# Altium project nestoGIT.PrjPcb
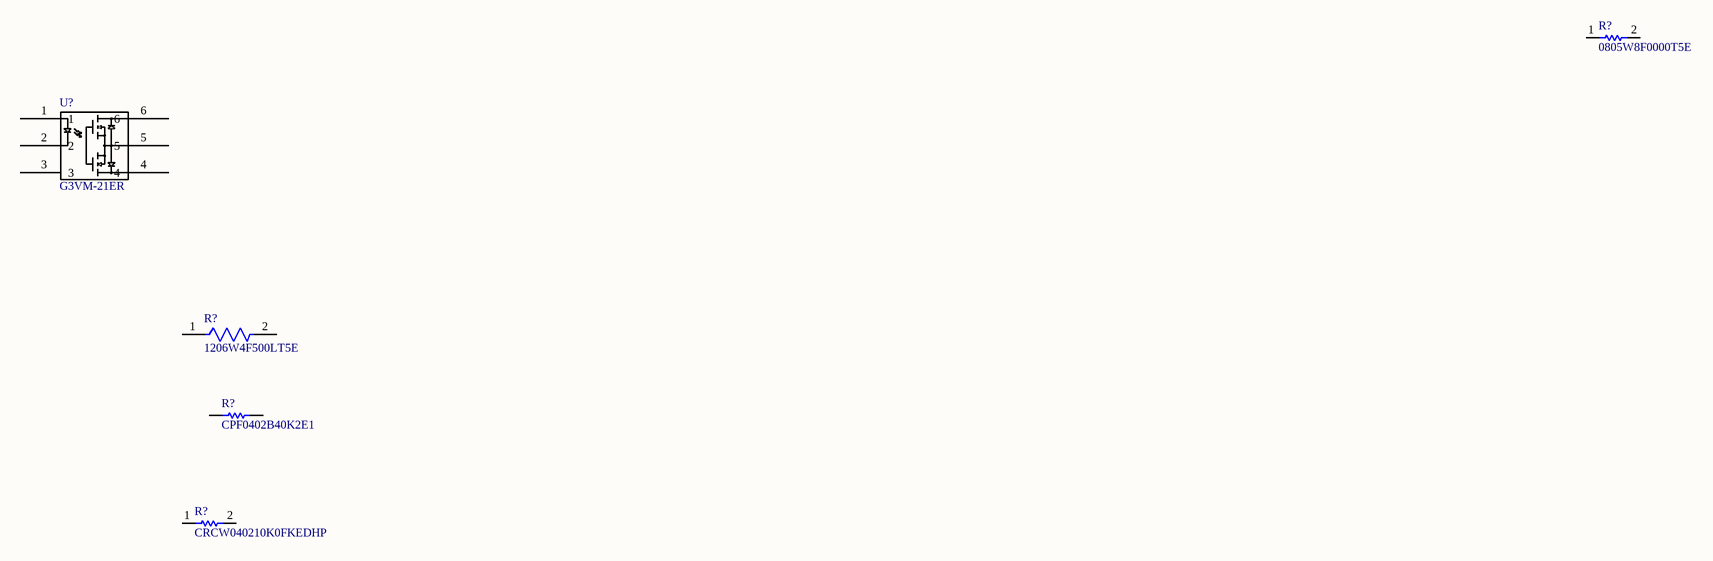
[diagram p0: Sheet1.SchDoc]
3 sheets, 21 parts. Net scope: global (net labels, ports and power ports of the same name join across sheets).
Sheets:
  Sheet1.SchDoc
  Sheet2.SchDoc
  Sheet3.SchDoc

## Sheet Sheet1.SchDoc
size A4; SheetNumber: 1; SheetTotal: 1

### Parts
(Parts that share a designator on the sheet are numbered #1, #2 ... from top to bottom, then left to right.)
R?#1  0805W8F0000T5E  [0805W8F0000T5E-Footprint-1]
R?#2  1206W4F500LT5E  [1206W4F500LT5E-Footprint-1]
R?#3  CPF0402B40K2E1  [RESC1005X35X20LL05T10]
R?#4  CRCW040210K0FKEDHP  [RESC1005X40X25NL05T10]
U?#1  G3VM-21ER  [G3VM-21ER-Footprint-1]

### Nets

Not connected (* = marked no-connect by the designer): R?#1 1 2; R?#2 1 2; R?#3 1 2; R?#4 1 2; U?#1 1 2 3 4 5 6

### Library data of the parts
R?#1 = CMP-003-00443-2: -55℃~+155℃ 0Ω 125mW 150V Thick Film Resistor ±1% ±800ppm/℃ 0805 Chip Resistor - Surface Mount ROHS; LCSC Part #: C17477
R?#2 = CMP-003-00393-1: -55℃~+155℃ 200V 250mW 500mΩ Thick Film Resistor ±1% ±800ppm/℃ 1206 Chip Resistor - Surface Mount ROHS; LCSC Part #: C25340
R?#3 = CMP-003-00249-1: Res Thin Film 0402 40.2K Ohm 0.1% 1/16W ±25ppm/°C Molded SMD SMD Paper T/R; Min Operating Temperature: -55°C; Width: 500µm; Max Operating Temperature: 155°C; Depth: 500µm; LCSC Part #: C4234771; Length: 990.6µm; Tolerance: 0.1%; Height: 300µm; Termination: Solder; Case/Package: 0402
R?#4 = CMP-003-00415-2: Res Thick Film 0402 10K Ohm 1% 0.2W ±100ppm/°C Molded SMD SMD Paper T/R; Max Operating Temperature: 155°C; Termination: SMD/SMT; Length: 1mm; Height: 300µm; Depth: 500µm; Lead Free: Lead Free; Packaging: Cut Tape; Pins: 2; Case/Package: 0402; Min Operating Temperature: -55°C; Tolerance: 1%; LCSC Part #: C71617; Width: 500µm
U?#1 = CMP-003-00232-1: Relay SSR 25mA 1.48V DC-IN 4A 16V AC/DC-OUT 6-Pin DIP SMD Stick; Length: 7.12mm; Height: 3.65mm; Max Operating Temperature: 65°C; Termination: Gull Wing; LCSC Part #: C6258783; Width: 6.4mm; Case/Package: SMD/SMT; Min Operating Temperature: -20°C; Pins: 6

## Sheet Sheet2.SchDoc
size A4; SheetNumber: 2; SheetTotal: 3
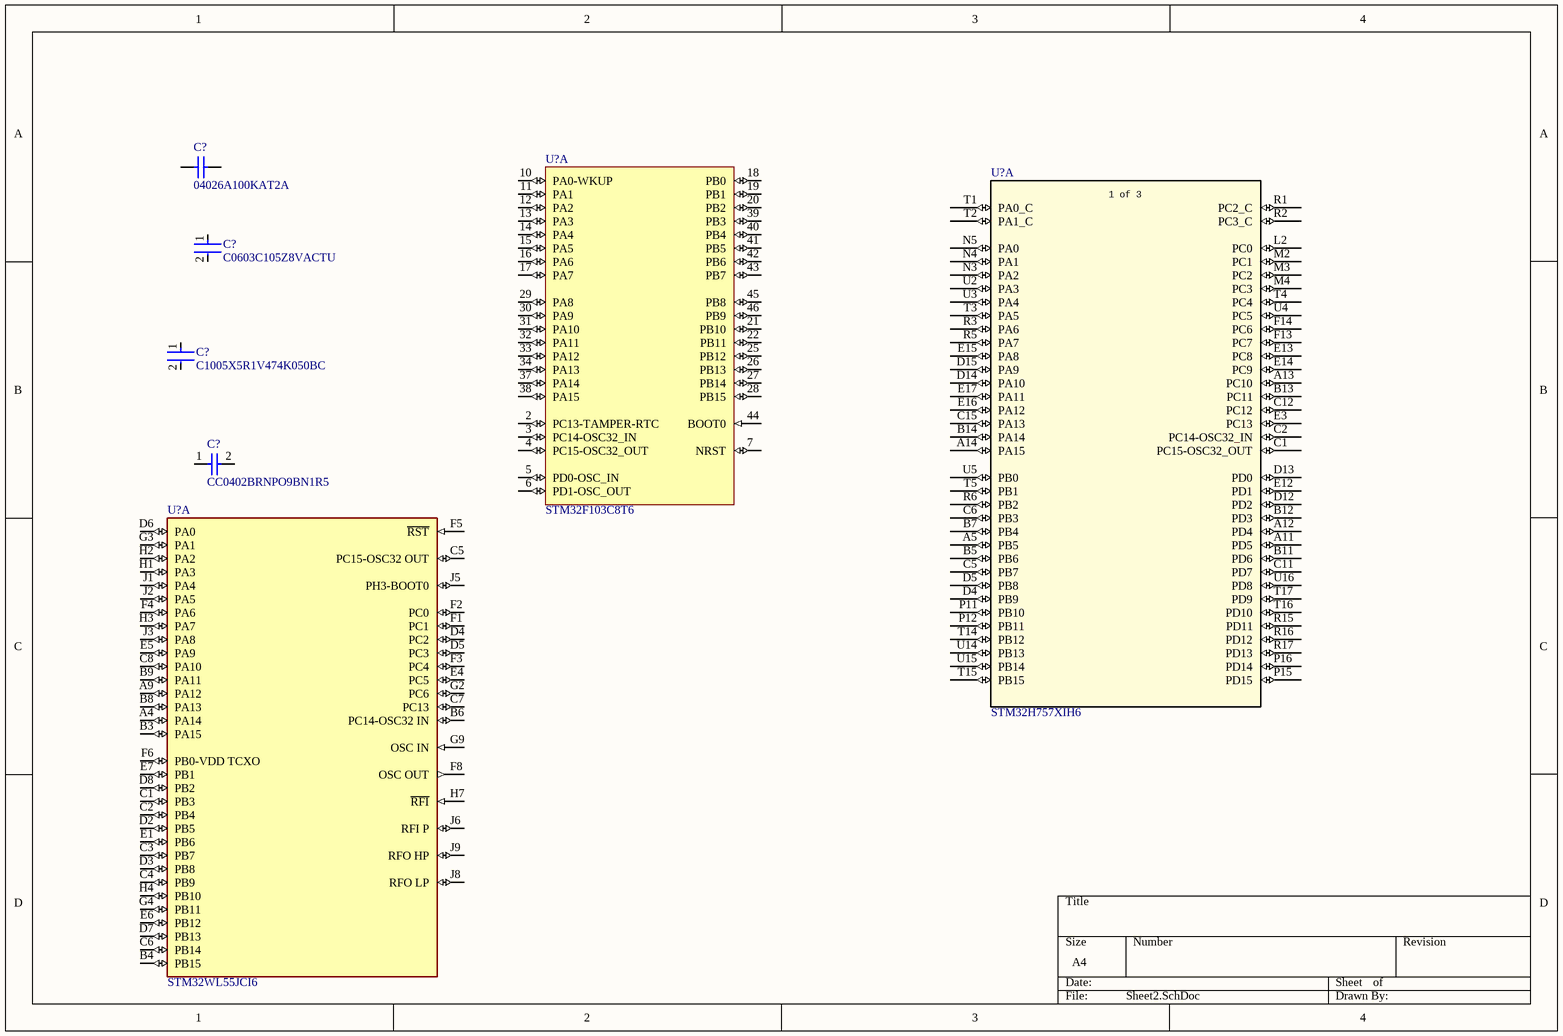
[diagram p1: Sheet2.SchDoc]

### Parts
(Parts that share a designator on the sheet are numbered #1, #2 ... from top to bottom, then left to right.)
C?#1  04026A100KAT2A  [CAPC1005X56X25LL10T15]
C?#2  C0603C105Z8VACTU  [FP-C0603-CG-IPC_A]
C?#3  C1005X5R1V474K050BC  [FP-C1005-050-0_05-IPC_A]
C?#4  CC0402BRNPO9BN1R5  [CC0402BRNPO9BN1R5-Footprint-1]
U?#2  STM32F103C8T6  [STM-LQFP48_M]  (part A of 2)
U?#3  STM32H757XIH6  [TFBGA240+25]  (part A of 4)
U?#4  STM32WL55JCI6  [FP-B08E_UFBGA73_ME-MFG]  (part A of 2)

### Nets

Not connected (* = marked no-connect by the designer): C?#1 1 2; C?#2 1 2; C?#3 1 2; C?#4 1 2; U?#2 2(PC13-TAMPER-RTC) 3(PC14-OSC32_IN) 4(PC15-OSC32_OUT) 5(PD0-OSC_IN) 6(PD1-OSC_OUT) 7(NRST) 10(PA0-WKUP) 11(PA1) 12(PA2) 13(PA3) 14(PA4) 15(PA5) 16(PA6) 17(PA7) 18(PB0) 19(PB1) 20(PB2) 21(PB10) 22(PB11) 25(PB12) 26(PB13) 27(PB14) 28(PB15) 29(PA8) 30(PA9) 31(PA10) 32(PA11) 33(PA12) 34(PA13) 37(PA14) 38(PA15) 39(PB3) 40(PB4) 41(PB5) 42(PB6) 43(PB7) 44(BOOT0) 45(PB8) 46(PB9); U?#3 A5(PB5) A11(PD5) A12(PD4) A13(PC10) A14(PA15) B5(PB6) B7(PB4) B11(PD6) B12(PD3) B13(PC11) B14(PA14) C1(PC15-OSC32_OUT) C2(PC14-OSC32_IN) C5(PB7) C6(PB3) C11(PD7) C12(PC12) C15(PA13) D4(PB9) D5(PB8) D12(PD2) D13(PD0) D14(PA10) D15(PA9) E3(PC13) E12(PD1) E13(PC8) E14(PC9) E15(PA8) E16(PA12) E17(PA11) F13(PC7) F14(PC6) L2(PC0) M2(PC1) M3(PC2) M4(PC3) N3(PA2) N4(PA1) N5(PA0) P11(PB10) P12(PB11) P15(PD15) P16(PD14) R1(PC2_C) R2(PC3_C) R3(PA6) R5(PA7) R6(PB2) R15(PD11) R16(PD12) R17(PD13) T1(PA0_C) T2(PA1_C) T3(PA5) T4(PC4) T5(PB1) T14(PB12) T15(PB15) T16(PD10) T17(PD9) U2(PA3) U3(PA4) U4(PC5) U5(PB0) U14(PB13) U15(PB14) U16(PD8); U?#4 A4(PA14) A9(PA12) B3(PA15) B4(PB15) B6(PC14-OSC32_IN) B8(PA13) B9(PA11) C1(PB3) C2(PB4) C3(PB7) C4(PB9) C5(PC15-OSC32_OUT) C6(PB14) C7(PC13) C8(PA10) D2(PB5) D3(PB8) D4(PC2) D5(PC3) D6(PA0) D7(PB13) D8(PB2) E1(PB6) E4(PC5) E5(PA9) E6(PB12) E7(PB1) F1(PC1) F2(PC0) F3(PC4) F4(PA6) F5(~{RST}) F6(PB0-VDD_TCXO) F8(OSC_OUT) G2(PC6) G3(PA1) G4(PB11) G9(OSC_IN) H1(PA3) H2(PA2) H3(PA7) H4(PB10) H7(~{RFI}) J1(PA4) J2(PA5) J3(PA8) J5(PH3-BOOT0) J6(RFI_P) J8(RFO_LP) J9(RFO_HP)

### Notes on the sheet
- (in symbol CMP-031-00008-3, part A) 1 of 3

### Library data of the parts
C?#1 = CMP-003-00182-1: Ceramic Capacitor, Multilayer, Ceramic, 6.3V, 10% +Tol, 10% -Tol, C0G, -/+30ppm/Cel TC, 0.00001uF, Surface Mount, 0402; Min Operating Temperature: -55°C; Termination: Wraparound; Packaging: Tape and Reel; Case/Package: 0402; Max Operating Temperature: 125°C; LCSC Part #: C2176086; Pins: 2
C?#2 = CMP-003-00432-1: Multilayer Ceramic Capacitor, 1 uF, 10 V, -20%, +80%, Y5V, 0603 [1608 Metric]; Tolerance: 80%; Width: 800µm; Height: 800µm; Max Operating Temperature: 85°C; Packaging: Cut Tape; Termination: SMD/SMT; Depth: 800µm; Length: 1.6mm; Min Operating Temperature: -30°C; Lead Free: Lead Free; LCSC part #: C2180996; Case/Package: 0603
C?#3 = CMP-003-00238-1: C 0402 (1005Metric) Ceramic Capacitor 0.039Lx0.020W 1.00mmx0.50mm X5R ±10% 0.47muF; Tolerance: 10%; Length: 1mm; Packaging: Cut Tape (CT); Max Operating Temperature: 85°C; Case/Package: 0402; Termination: SMD/SMT; LCSC Part £: C3852634; Height: 500µm; Width: 500µm; Lead Free: Lead Free; Min Operating Temperature: -55°C
C?#4 = CMP-003-00316-1: Surface Mount Ceramic Multilayer Capacitor 1.5pF 0.1pF C0G 50V 0402 Paper T/R; Case/Package: 0402; Max Operating Temperature: 125°C; Width: 500µm; Height: 500µm; LCSC Part #: C282238; Min Operating Temperature: -55°C; Depth: 500µm; Termination: SMD/SMT; Pins: 2; Lead Free: Lead Free; Length: 1mm; Packaging: Tape and Reel
U?#2 = CMP-003-00158-1: RISC Microcontroller, 32-Bit, FLASH, STM32 CPU, 72MHz, CMOS, PQFP48; Min Operating Temperature: -40°C; LCSC Part #: C8734; Pins: 48; Length: 7mm; Case/Package: LFQFP; Width: 7mm; Max Operating Temperature: 105°C
U?#3 = CMP-031-00008-3: High-performance and DSP with DP-FPU, Arm Cortex-M7 + Cortex-M4 MCU with 2MBytes of Flash memory, 1MB RAM, 480 MHz CPU, Art Accelerator, L1 cache, external memory interface, large set of peripherals including a Crypto accelerator, SMPS; Manufacturer_Name: STMicroelectronics; LCSC Part #: C1343741; Copyright: Copyright (C) 2025 Ultra Librarian. All rights reserved.; Component Type: Standard; Source: STM32H757XIH6.SchLib; Manufacturer_Part_Number: STM32H757XIH6; RefDes: RefDes; Design Item ID: STM32H757XIH6; Type: Type; Pins: 265
U?#4 = CMP-003-00217-5: STM32WL Series 256 kB Flash 64 kB RAM 960 MHz 32-Bit Microcontroller - UFBGA-73. POVECAN PRECNIK PADOVA ZBOG JLCPCB PRAVILA; Component Type: BGA; Min Operating Temperature: -40°C; Height: 600µm; LCSC Part #: C2969982; Max Operating Temperature: 85°C

## Sheet Sheet3.SchDoc
size A4; SheetNumber: 3; SheetTotal: 3
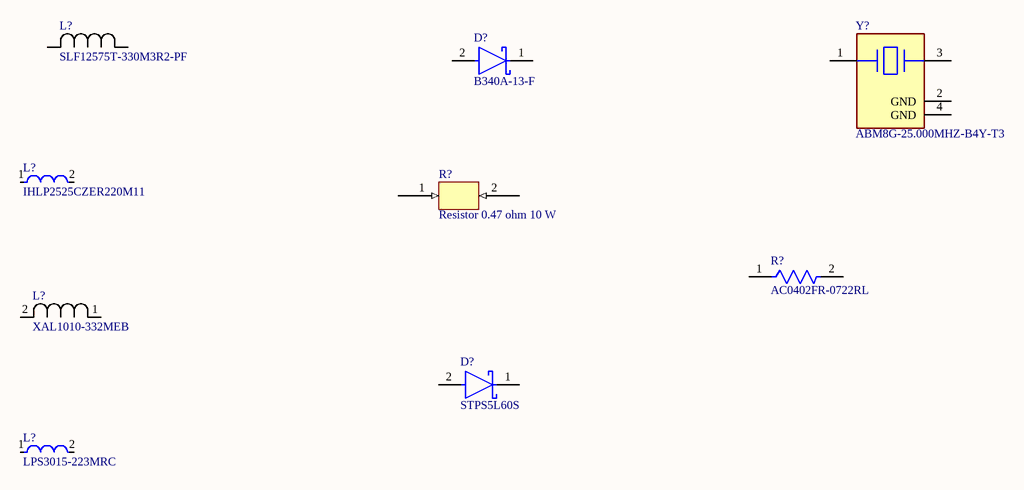
[diagram p2: Sheet3.SchDoc]

### Parts
(Parts that share a designator on the sheet are numbered #1, #2 ... from top to bottom, then left to right.)
D?#1  B340A-13-F  [FP-SMA-MFG]
D?#2  STPS5L60S  [DIOM6959X26N]
L?#1  SLF12575T-330M3R2-PF  [IND_12575_TDK]
L?#2  IHLP2525CZER220M11  [FP-IHLP-2525CZ-FP_2_413x3-MFG]
L?#3  XAL1010-332MEB  [XAL1010-332MEB-Footprint-1]
L?#4  LPS3015-223MRC  [FP-LPS3015-MFG]
R?#5  Resistor 0.47 ohm 10 W  [DIOMELF3516N]
R?#6  AC0402FR-0722RL  [FP-AC0402-IPC_A]
Y?  ABM8G-25.000MHZ-B4Y-T3  [FP-ABM8G-MFG]

### Nets

Not connected (* = marked no-connect by the designer): D?#1 1(C) 2(A); D?#2 1(C) 2(A); L?#1 1 2; L?#2 1 2; L?#3 1 2; L?#4 1 2; R?#5 1 2; R?#6 1 2; Y? 1 2(GND) 3 4(GND)

### Library data of the parts
D?#1 = CMP-003-00173-2: Rectifier Diode, Schottky, 1 Phase, 1 Element, 3A, 40V V(RRM), Silicon; Manufacturer: Diodes Incorporated; Max Operating Temperature: 125°C; LCSC Part #: C85098; Pins: 2; Manufact. No.: B340A-13-F; Min Operating Temperature: -55°C
D?#2 = CMP-003-00102-3: Rectifier Diode, Schottky, 1 Phase, 1 Element, 5A, 60V V(RRM), Silicon; Max Operating Temperature: 150°C; Pins: 2; LCSC Part #: C140620
L?#1 = CMP-006-00021-3: 3.2A 33uH ±20% 3.2A SMD,12.5x12.5mm Power Inductors ROHS; Mfr_Name: TDK; LCSC Part #: C87568; Source: SLF12575T-330M3R2-PF.SchLib; Component Type: Standard; Design Item ID: SLF12575T-330M3R2-PF; Manufacturer: TDK; Manufact. No.: SLF12575T-330M3R2-PF; Pins: 2
L?#2 = CMP-003-00045-1: General Purpose Inductor, 22uH, 20%, 1 Element, Composite-Core, SMD, 2525; Min Operating Temperature: -55°C; Pins: 2; Packaging: Tape and Reel; Tolerance: 20%; LCSC Part #: C845021; Max Operating Temperature: 125°C; Termination: Wraparound
L?#3 = CMP-003-00401-1: General Purpose Inductor, 3.3uH, 20%, 1 Element, Composite-Core, SMD, 4539; Packaging: Cut Tape; LCSC Part #: C43239891; Length: 11.8mm; Lead Free: Contains Lead; Tolerance: 20%; Termination: SMD/SMT; Min Operating Temperature: -40°C; Case/Package: SMD/SMT; Max Operating Temperature: 125°C; Width: 10mm; Height: 10mm
L?#4 = CMP-003-00235-1: General Purpose Inductor, 22uH, 20%, 1 Element, Ferrite-Core, SMD, 1212; Case/Package: 1212; Height: 1.4mm; Termination: SMD/SMT; Tolerance: 20%; Min Operating Temperature: -40°C; LCSC Part #: C5441602; Width: 2.95mm; Length: 3mm; Max Operating Temperature: 125°C
R?#5 = CMP-003-00201-1: otprilike nacrtan R, za dokumentaciju o MAGTROL-u
R?#6 = CMP-003-00333-1: Res Thick Film 0402 22 Ohm 1% 0.063W(1/16W) ±100ppm/C Pad SMD Automotive T/R; Width: 500µm; Tolerance: 1%; LCSC Part #: C226359; Max Operating Temperature: 155°C; Lead Free: Lead Free; Packaging: Tape & Reel; Termination: SMD/SMT; Case/Package: 0402; Length: 990.6µm; Min Operating Temperature: -55°C; Height: 320µm
Y? = CMP-003-00034-2: Crystal 25MHz ±30ppm (Tol) ±30ppm (Stability) 10pF FUND 60Ohm 4-Pin Ultra Mini-CSMD T/R; LCSC Part #: C596913